# EAGLE design Apex4ROBOTS_UI_1_0 (EAGLE 9.5.2)
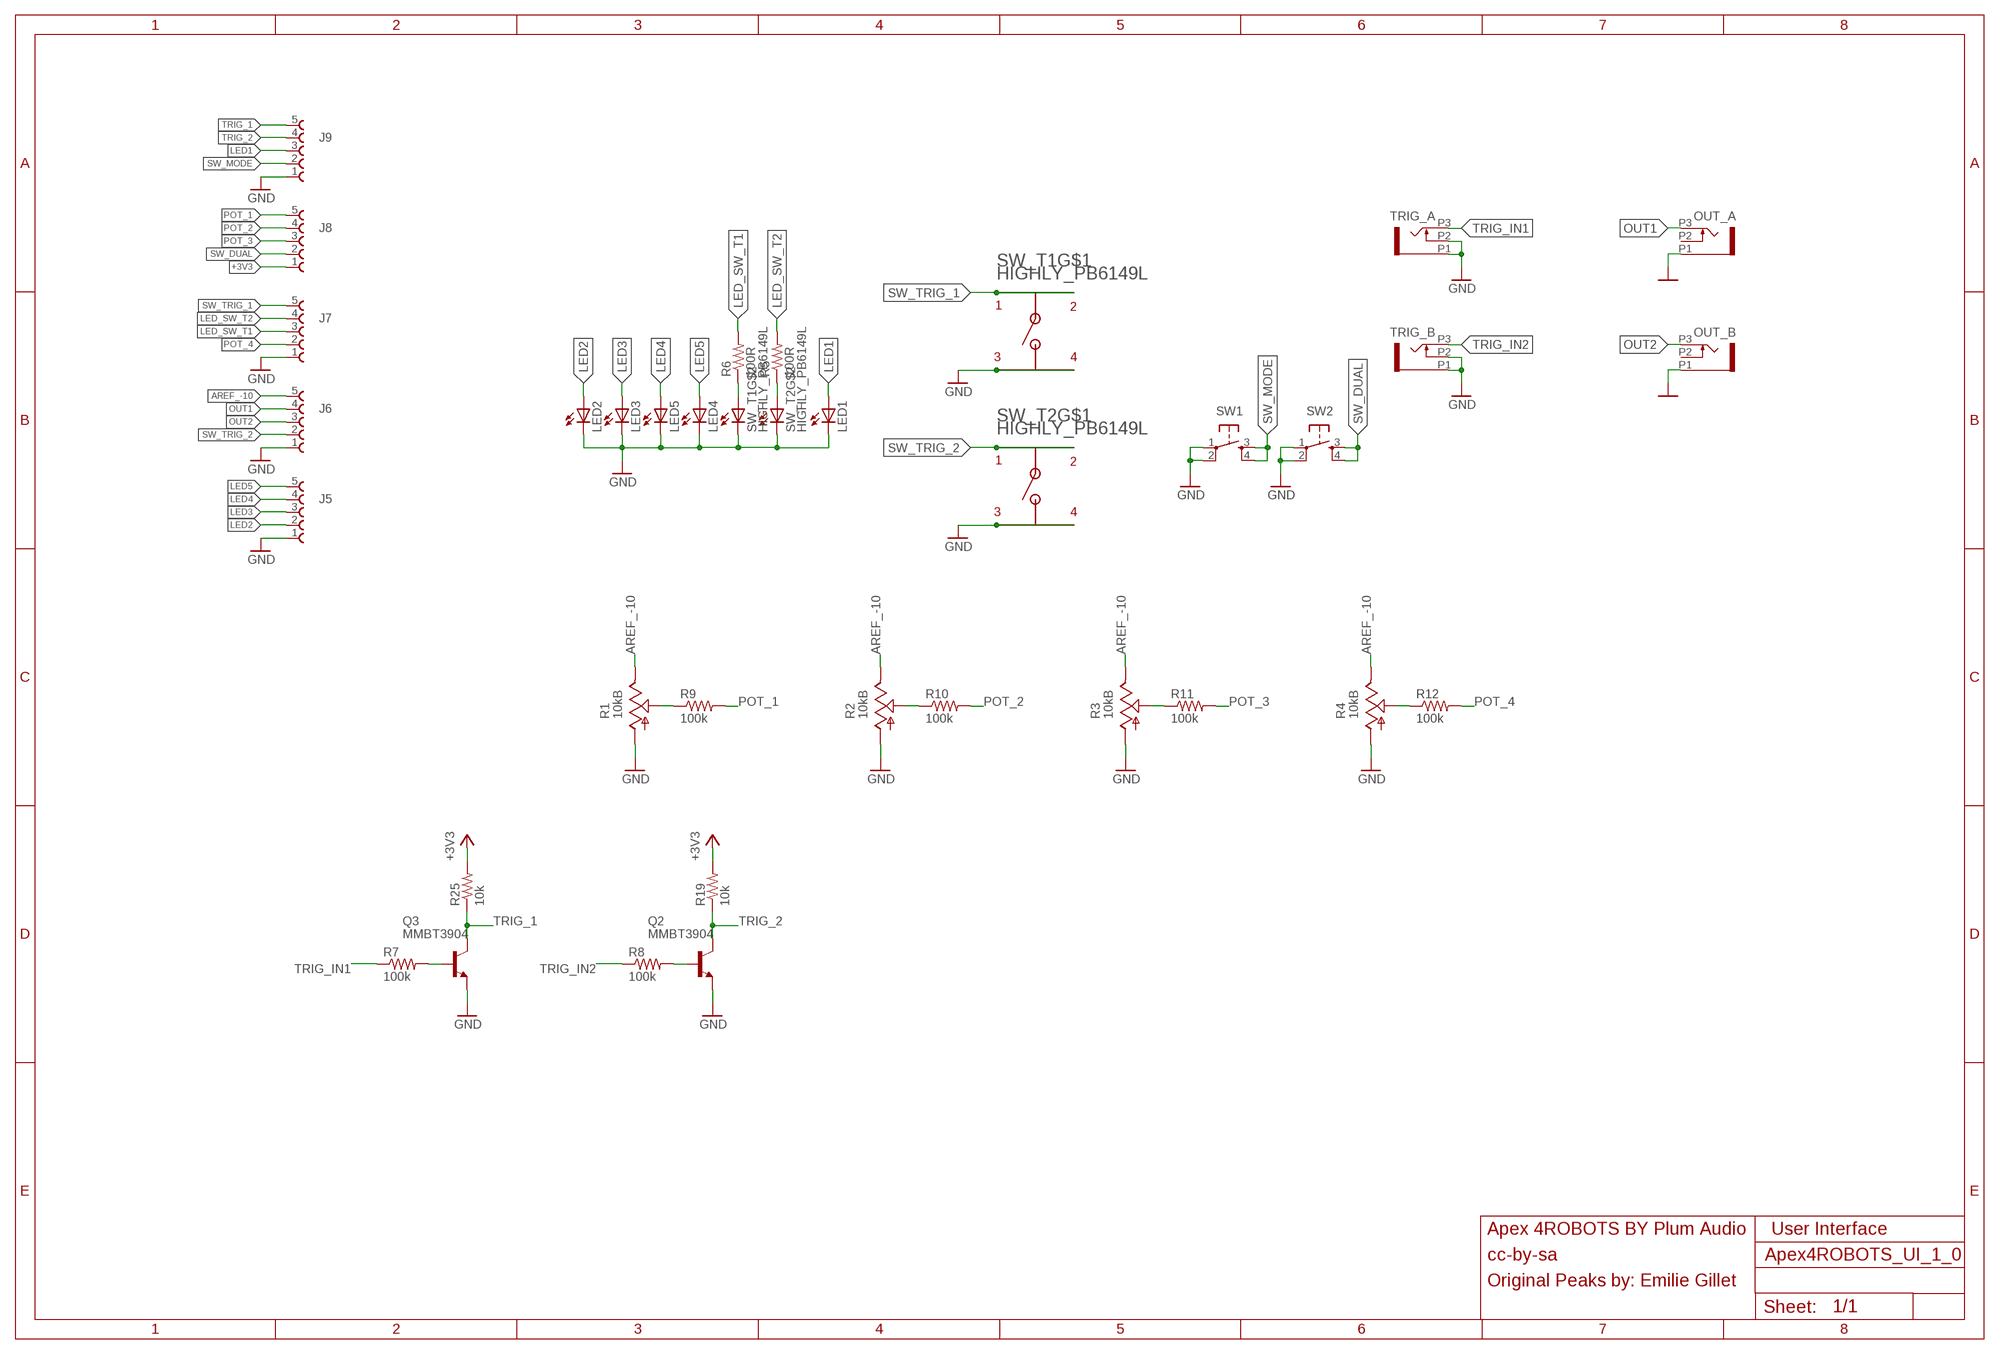
[diagram p0: schematic, sheet 1]

## Parts
J5  61300511121  [61300511121]
J6  61300511121  [61300511121]
J7  61300511121  [61300511121]
J8  61300511121  [61300511121]
J9  61300511121  [61300511121]
LED1  LED3MM  [LED3MM]
LED2  LED3MM  [LED3MM]
LED3  LED3MM  [LED3MM]
LED4  LED3MM  [LED3MM]
LED5  LED3MM  [LED3MM]
OUT_A  OG-PJ301_PJ301_THONKICONN6  [OG-PJ301_WQP_PJ_301M6]
OUT_B  OG-PJ301_PJ301_THONKICONN6  [OG-PJ301_WQP_PJ_301M6]
Q2  MMBT3904  MMBT3904LT1-NPN-SOT23-BEC  [SOT23-BEC]
Q3  MMBT3904  MMBT3904LT1-NPN-SOT23-BEC  [SOT23-BEC]
R1  10kB  POTS_POT_USSLOTED_TALL_TRIMMER  [POTS_TALL_TRIMMER_POT_VERTICAL_SLOTED]
R2  10kB  POTS_POT_USSLOTED_TALL_TRIMMER  [POTS_TALL_TRIMMER_POT_VERTICAL_SLOTED]
R3  10kB  POTS_POT_USSLOTED_TALL_TRIMMER  [POTS_TALL_TRIMMER_POT_VERTICAL_SLOTED]
R4  10kB  POTS_POT_USSLOTED_TALL_TRIMMER  [POTS_TALL_TRIMMER_POT_VERTICAL_SLOTED]
R5  100R  R-US_R0603  [R0603]
R6  100R  R-US_R0603  [R0603]
R7  100k  R-US_R0603  [R0603]
R8  100k  R-US_R0603  [R0603]
R9  100k  R-US_R0603  [R0603]
R10  100k  R-US_R0603  [R0603]
R11  100k  R-US_R0603  [R0603]
R12  100k  R-US_R0603  [R0603]
R19  10k  R-US_R0603  [R0603]
R25  10k  R-US_R0603  [R0603]
SW1  TAC_SWITCHPTH  [TACTILE-PTH]
SW2  TAC_SWITCHPTH  [TACTILE-PTH]
SW_T1  HIGHLY_PB6149L  [HIGHLY_PB64149L]
SW_T2  HIGHLY_PB6149L  [HIGHLY_PB64149L]
TRIG_A  OG-PJ301_PJ301_THONKICONN6  [OG-PJ301_WQP_PJ_301M6]
TRIG_B  OG-PJ301_PJ301_THONKICONN6  [OG-PJ301_WQP_PJ_301M6]

## Nets
+3V3: J8.1 R19.2 R25.2
AREF_-10: J6.5 R1.P$1(E) R2.P$1(E) R3.P$1(E) R4.P$1(E)
GND: J5.1 J6.1 J7.1 J9.1 LED1.K(C) LED2.K(C) LED3.K(C) LED4.K(C) LED5.K(C) OUT_A.P1 OUT_B.P1 Q2.E Q3.E R1.P$3(A) R2.P$3(A) R3.P$3(A) R4.P$3(A) SW1.1 SW1.2 SW2.1 SW2.2 SW_T1.L2 SW_T1.P$3 SW_T1.P$4 SW_T2.L2 SW_T2.P$3 SW_T2.P$4 TRIG_A.P1 TRIG_A.P2 TRIG_B.P1 TRIG_B.P2
LED1: J9.3 LED1.A
LED2: J5.2 LED2.A
LED3: J5.3 LED3.A
LED4: J5.4 LED5.A
LED5: J5.5 LED4.A
LED_SW_T1: J7.3 R6.2
LED_SW_T2: J7.4 R5.2
N$1: R5.1 SW_T2.L1
N$2: R6.1 SW_T1.L1
N$3: R1.P$2(S) R9.1
N$4: R2.P$2(S) R10.1
N$5: R3.P$2(S) R11.1
N$6: R4.P$2(S) R12.1
N$14: Q2.B R8.2
N$66: Q3.B R7.2
OUT1: J6.4 OUT_A.P3
OUT2: J6.3 OUT_B.P3
POT_1: J8.5 R9.2
POT_2: J8.4 R10.2
POT_3: J8.3 R11.2
POT_4: J7.2 R12.2
SW_DUAL: J8.2 SW2.3 SW2.4
SW_MODE: J9.2 SW1.3 SW1.4
SW_TRIG_1: J7.5 SW_T1.P$1 SW_T1.P$2
SW_TRIG_2: J6.2 SW_T2.P$1 SW_T2.P$2
TRIG_1: J9.5 Q3.C R25.1
TRIG_2: J9.4 Q2.C R19.1
TRIG_IN1: R7.1 TRIG_A.P3
TRIG_IN2: R8.1 TRIG_B.P3
Unconnected: OUT_A.P2 OUT_B.P2

## Notes on the sheet
- Apex 4ROBOTS BY Plum Audio | User Interface
- cc-by-sa
- Original Peaks by: Emilie Gillet

## Library data of the parts
J5-J9 = Wurth_Elektronik_Electromechanic_Board_to_Board_Connectors_rev17a:61300511121: WR-PHD 2.54mm Pin Header, 5 Pin =>Code : Con_BTB_PHD_2.54_1_THT_61300511121 <http://katalog.we-online.de/media/images/eican/Con_BTB_PHD_2.54_1_THT_6130xx11121_pf2.jpg> Details see: http://katalog.we-online.de/en/em/613_0xx_111_21 Created 2014-05-29, Karrer Zheng 2014 (C) Würth Elektronik
LED1-LED5 = led:LED: LED OSRAM: - CHIPLED LG R971, LG N971, LY N971, LG Q971, LY Q971, LO R971, LY R971 LH N974, LH R974 LS Q976, LO Q976, LY Q976 LO Q996 - Hyper CHIPLED LW Q18S LB Q993, LB Q99A, LB R99A - SideLED LS A670, LO A670, LY A670, LG A670, LP A670 LB A673, LV A673, LT A673, LW A673 LH A674 LY A675 LS A676, LA A676, LO A676, LY A676, LW A676 LS A679, LY A679, LG A679 - Hyper Micro SIDELED® LS Y876, LA Y876, LO Y876, LY Y876 LT Y87S - SmartLED LW L88C, LW L88S LB L89C, LB L89S, LG L890 LS L89K, LO L89K, LY L89K LS L896, LA L896, LO L896, LY L896 - TOPLED LS T670, LO T670, LY T670, LG T670, LP T670 LSG T670, LSP T670, LSY T670, LOP T670, LYG T670 LG T671, LOG T671, LSG T671 LB T673, LV T673, LT T673, LW T673 LH T674 LS T676, LA T676, LO T676, LY T676, LB T676, LH T676, LSB T676, LW T676 LB T67C, LV T67C, LT T67C, LS T67K, LO T67K, LY T67K, LW E67C LS E67B, LA E67B, LO E67B, LY E67B, LB E67C, LV E67C, LT E67C LW T67C LS T679, LY T679, LG T679 LS T770, LO T770, LY T770, LG T770, LP T770 LB T773, LV T773, LT T773, LW T773 LH T774 LS E675, LA E675, LY E675, LS T675 LS T776, LA T776, LO T776, LY T776, LB T776 LHGB T686 LT T68C, LB T68C - Hyper Mini TOPLED® LB M676 - Mini TOPLED Santana® LG M470 LS M47K, LO M47K, LY M47K Source: http://www.osram.convergy.de LUXEON: - LUMILED® LXK2-PW12-R00, LXK2-PW12-S00, LXK2-PW14-U00, LXK2-PW14-V00 LXK2-PM12-R00, LXK2-PM12-S00, LXK2-PM14-U00 LXK2-PE12-Q00, LXK2-PE12-R00, LXK2-PE12-S00, LXK2-PE14-T00, LXK2-PE14-U00 LXK2-PB12-K00, LXK2-PB12-L00, LXK2-PB12-M00, LXK2-PB14-N00, LXK2-PB14-P00, LXK2-PB14-Q00 LXK2-PR12-L00, LXK2-PR12-M00, LXK2-PR14-Q00, LXK2-PR14-R00 LXK2-PD12-Q00, LXK2-PD12-R00, LXK2-PD12-S00 LXK2-PH12-R00, LXK2-PH12-S00 LXK2-PL12-P00, LXK2-PL12-Q00, LXK2-PL12-R00 Source: www.luxeon.com KINGBRIGHT: KA-3528ASYC Source: www.kingbright.com
OUT_A OUT_B TRIG_A TRIG_B = SHAY_THONKICONNS:OG-PJ301_PJ301_THONKICONN
Q2 Q3 = transistor:*-NPN-: NPN Transistror BF959 corrected 2008.03.06
R1-R4 = POTS:POTS_POT_US
R5-R12 R19 R25 = rcl:R-US_: RESISTOR, American symbol
SW1 SW2 = SparkFun:TAC_SWITCH: Momentary Switch Button commonly used for reset or general input. Spark Fun Electronics SKU : COM-00097
SW_T1 = HIGHLY PB6149L:HIGHLY_PB6149L; SPICEPREFIX: S
SW_T2 = HIGHLY PB6149L:HIGHLY_PB6149L

## Board
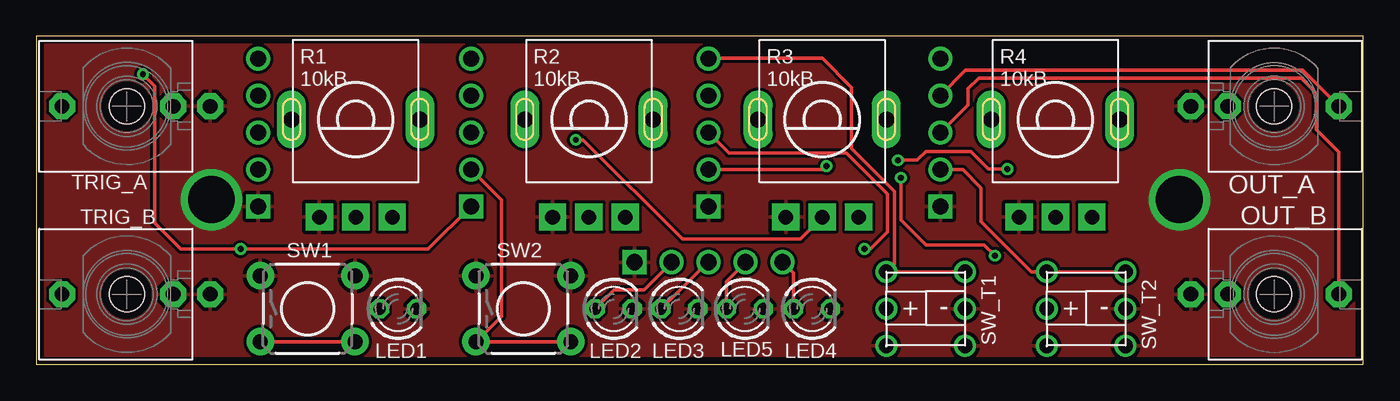
[diagram p1: board, top side]
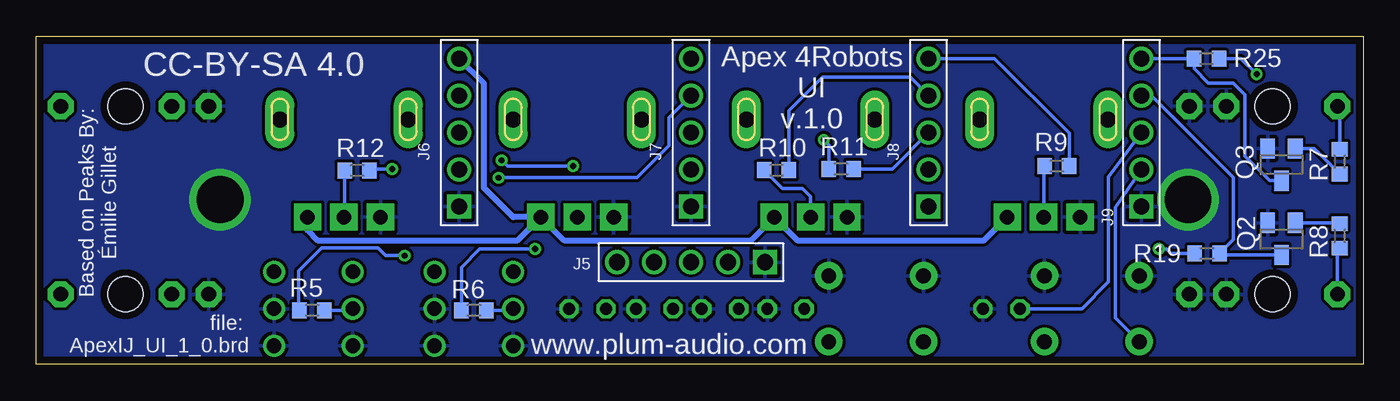
[diagram p2: board, bottom side, seen from below]

Size 91 x 22.5 mm. Coordinates in mm from the lower left corner, seen from the top.
Outline: 0,0 91,0 91,22.5 0,22.5 0,0
Copper layers (1*16): Top 0.035mm / dielectric 1.5mm / Bottom 0.035mm
Design rules "default *": minimum track width 8mil, minimum drill 0.4mm, track to track 8mil, track to pad 6mil, pad to pad 6mil, via to via 6mil, smd to smd 6mil, copper to edge 20mil, drill to drill 6mil, minimum pad ring 10mil, minimum via ring 8mil, stop-mask expansion 4mil, vias tented up to drill 25mil, thermal gap 10mil

### Footprints (pad centres in the part's own frame; a part is rotated, then mirrored left to right if it is on the bottom)
61300511121 = drill 1.1 square: 1 -5.08,0 | drill 1.1: 2 -2.54,0; 3 0,0; 4 2.54,0; 5 5.08,0
LED3MM = drill 0.813 octagon: A -1.27,0; K 1.27,0
OG-PJ301_WQP_PJ_301M6 = drill 1.016 pad 1.778 octagon: P1 0,-5.715; P2 0,-3.175; P3 0,4.445 | hole 2.4: 0,0
SOT23-BEC = smd 1 x 1.4: B -0.95,-1.1; C 0,1.1; E 0.95,-1.1
POTS_TALL_TRIMMER_POT_VERTICAL_SLOTED = drill 1 pad 1.88 square: P$1 -2.5,6.7; P$2 0,6.7; P$3 2.5,6.7 | drill 1.1 pad 2 long: P$4 -4.4,0; P$5 4.4,0
R0603 = smd 1 x 1.1: 1 -0.85,0; 2 0.85,0
TACTILE-PTH = drill 1.016 pad 1.88: 1 -3.251,2.261; 2 3.251,2.261; 3 -3.251,-2.261; 4 3.251,-2.261
HIGHLY_PB64149L = drill 1: L1 0,-2.7; L2 0,2.7; P$1 -2.54,-2.7; P$2 -2.54,2.7; P$3 2.54,-2.7; P$4 2.54,2.7

### Placement (x,y rotation side)
J5  46.1,7 180 bottom
J6  62,15.9 90 bottom
J7  46.1,15.9 90 bottom
J8  29.8,15.9 90 bottom
J9  15.2,15.9 90 bottom
LED1  24.8,3.8 0 top
LED2  39.6,3.8 0 top
LED3  44.1,3.8 0 top
LED4  53.2,3.8 0 top
LED5  48.6,3.8 0 top
OUT_A  84.9,17.7 270 top
OUT_B  84.9,4.8 270 top
Q2  5.6,8.6 180 bottom
Q3  5.6,13.7 180 bottom
R1  21.9,16.8 180 top
R2  37.9,16.8 180 top
R3  53.9,16.8 180 top
R4  69.9,16.8 180 top
R5  72.1,3.7 180 bottom
R6  61,3.7 180 bottom
R7  1.6,13.9 270 bottom
R8  1.6,8.8 90 bottom
R9  21,13.6 0 bottom
R10  40.24,13.32 0 bottom
R11  35.8,13.4 0 bottom
R12  69,13.3 0 bottom
R19  10.7,7.6 180 bottom
R25  10.74,20.97 0 bottom
SW1  18.6,3.8 0 top
SW2  33.4,3.8 0 top
SW_T1  61,3.8 270 top
SW_T2  72,3.8 270 top
TRIG_A  6.2,17.7 90 top
TRIG_B  6.2,4.8 90 top

### Tracks (layer width: path | path; a pad name or v marks a point on that pad's centre or on a via)
+3V3  (via drill 0.4)
  Top 0.254: v7.3,19.9 8.1,19.1 8.1,9.7 9.55,8.25 9.8,8 9.9,7.9 v14,7.9 26.88,7.9 J8.1
  Bottom 0.254: R19.2 13.2,7.6 13.5,7.9 v14,7.9 | R25.2 8.37,20.97 v7.3,19.9
AREF_-10
  Bottom 0.406: R4.P$1 72.4,9.2 71.7,8.5 58,8.5 R3.P$1 | R1.P$1 26,8.5 38.8,8.5 R2.P$1 42,8.5 54.8,8.5 R3.P$1 | J6.5 60.3,19.28 60.3,12.1 58.3,10.1 R3.P$1
GND  (via drill 3.2)
  other vias: 12,11.3 78.4,11.3
  pour Top: 0,22.4 0,0.1 91,0.1 91,22.4
  pour Bottom: 0,22.4 0,0.1 91,0.1 91,22.4
LED1
  Bottom 0.254: LED1.A 19.3,3.8 17.46,5.64 17.46,12.84 J9.3
LED2
  Top 0.254: LED2.A 39.63,5.1 41.66,5.1 J5.2
LED3
  Top 0.254: LED3.A 46.03,7 J5.3
LED4
  Top 0.254: LED5.A 47.33,5.69 J5.4
LED5
  Top 0.254: J5.5 51.93,6.25 LED4.A
LED_SW_T1  (via drill 0.4)
  Top 0.254: J7.3 47.5,14.5 55.55,14.5 58.39,11.67 58.39,9.09 57.2,7.9 v56.8,7.9
  Bottom 0.254: v56.8,7.9 60.6,7.9 61.85,6.65 R6.2
LED_SW_T2  (via drill 0.4)
  Top 0.254: v59.3,12.8 59.3,9.9 61,8.2 65,8.2 v65.75,7.45
  Bottom 0.254: v59.3,12.8 57.2,12.8 56.8,12.8 49.8,12.8 47.6,15 47.6,16.94 J7.4 | R5.2 73,3.75 73,6.4 71.43,7.97 67.57,7.97 67.05,7.45 v65.75,7.45
N$1
  Bottom 0.254: R5.1 69.4,3.7 SW_T2.L1
N$2
  Bottom 0.254: R6.1 58.4,3.7 SW_T1.L1
N$3
  Bottom 0.254: R1.P$2 21.9,13.55 R9.1
N$4
  Bottom 0.254: R10.1 39.84,12.06 38.47,12.06 37.9,11.5 R2.P$2
N$5  (via drill 0.4)
  Top 0.254: R3.P$2 52.4,8.6 44.3,8.6 37.5,15.4 v37,15.4
  Bottom 0.254: v37,15.4 36.65,15.05 R11.1
N$6
  Bottom 0.254: R4.P$2 69.85,10.15 R12.1
N$14
  Bottom 0.254: R8.2 1.65,9.7 Q2.B
N$66
  Bottom 0.254: R7.2 3.35,14.8 Q3.B
OUT1
  Top 0.254: J6.4 63.73,20.17 86.88,20.17 OUT_A.P3
OUT2
  Top 0.254: OUT_B.P3 89.34,14.55 87.8,16.1 87.8,18.6 86.75,19.65 64.65,19.65 63.9,18.9 63.9,17.8 J6.3
POT_1
  Bottom 0.254: R9.2 20.15,15.85 25.28,20.98 J8.5
POT_2
  Bottom 0.254: R10.2 39.39,17.41 37.1,19.7 31.06,19.7 J8.4
POT_3
  Top 0.254: 30.6,15.9 J8.3
  Bottom 0.254: R11.2 32.3,13.4 J8.3
POT_4  (via drill 0.4)
  Top 0.254: J7.2 53.96,13.36 v54.2,13.6 | v59.1,14 60.4,14 61,14.6 64.1,14.6 65.3,13.4 v66.6,13.4
  Bottom 0.254: v54.2,13.6 58.7,13.6 v59.1,14 | v66.6,13.4 68.05,13.4 R12.2
SW_DUAL
  Top 0.254: SW2.4 SW2.3 31.9,3.29 31.9,11.26 J8.2
SW_MODE
  Top 0.254: SW1.3 SW1.4
  Bottom 0.254: SW1.3 17,3.19 17,10.76 J9.2
SW_TRIG_1
  Top 0.254: SW_T1.P$2 SW_T1.P$1 58.84,6.88 58.84,11.86 55.9,14.8 55.9,19 53.9,21 46.12,21 J7.5
SW_TRIG_2
  Top 0.254: SW_T2.P$2 SW_T2.P$1 68.26,6.34 64.8,9.8 64.8,12.1 63.54,13.36 J6.2
TRIG_1
  Bottom 0.254: Q3.C 6.4,12.6 8.1,14.3 8.1,18.5 8.9,19.3 10.6,19.3 11.59,20.29 R25.1 J9.5
TRIG_2
  Bottom 0.254: Q2.C 9.75,7.5 R19.1 8.9,8.55 8.9,12.8 14.54,18.44 J9.4
TRIG_IN1
  Bottom 0.254: TRIG_A.P3 1.6,17.55 R7.1
TRIG_IN2
  Bottom 0.254: TRIG_B.P3 1.75,7.79 R8.1

### Text on the board
bPlace: CC-BY-SA 4.0 | Apex 4Robots / UI / v.1.0 | Based on Peaks By: / Émilie Gillet | www.plum-audio.com | file: / ApexIJ_UI_1_0.brd